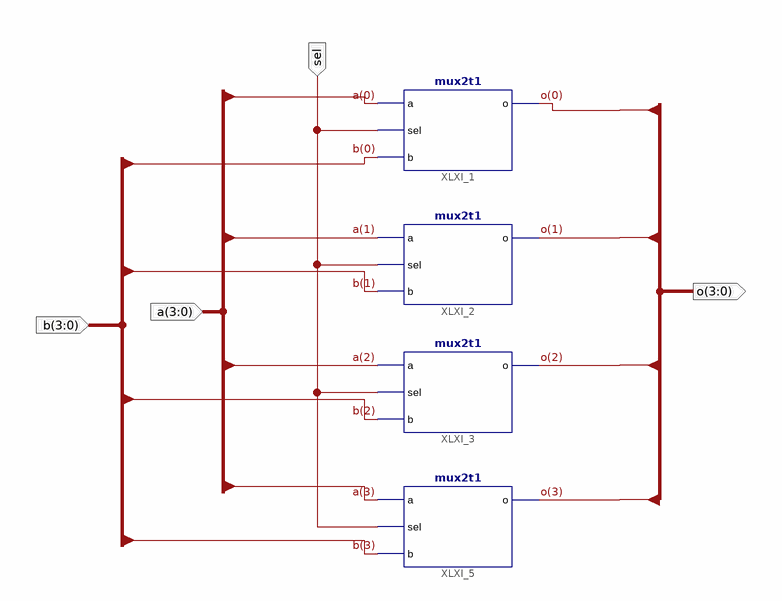
[diagram p0: schematic sheet 1]
// Xilinx ISE schematic mux4t1.sch (kintex7) as structural Verilog: 4 symbols, 4 ports
module mux4t1 (
  input  [3:0] a,
  input  sel,
  input  [3:0] b,
  output [3:0] o
);

  mux2t1 XLXI_1 (.a(a[0]), .sel(sel), .b(b[0]), .o(o[0]));
  mux2t1 XLXI_2 (.a(a[1]), .sel(sel), .b(b[1]), .o(o[1]));
  mux2t1 XLXI_3 (.a(a[2]), .sel(sel), .b(b[2]), .o(o[2]));
  mux2t1 XLXI_5 (.a(a[3]), .sel(sel), .b(b[3]), .o(o[3]));
endmodule
